# Altium project testSensor.PrjPcb
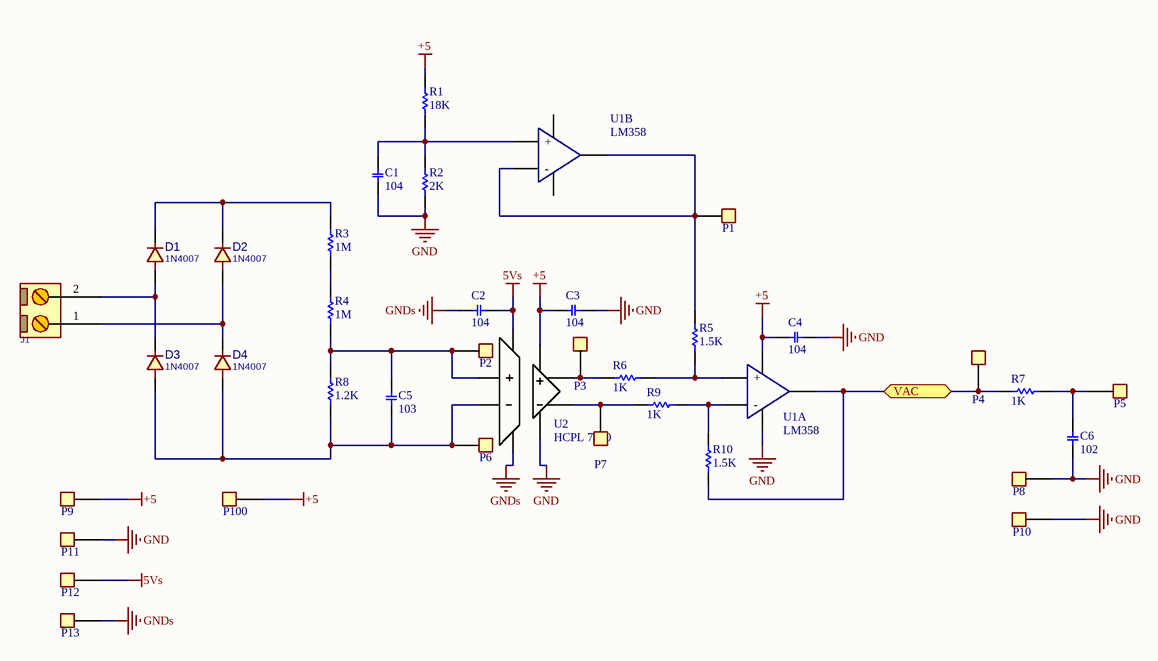
[diagram p0: testSensor.SchDoc]
1 sheet, 37 parts. Net scope: flat (ports and power ports of the same name join across sheets).
Board file: testSensor.PcbDoc

## Sheet testSensor.SchDoc
size A4; SheetNumber: 1; SheetTotal: 1

### Parts
C1  104  [CAP 104]
C2  104  [CAP 104]
C3  104  [CAP 104]
C4  104  [CAP 104]
C5  103  [CAP 104]
C6  102  [CAP 104]
D1  value 1N4007  [1N4007]  (hidden comment: DIODE DIP)
D2  value 1N4007  [1N4007]  (hidden comment: DIODE DIP)
D3  value 1N4007  [1N4007]  (hidden comment: DIODE DIP)
D4  value 1N4007  [1N4007]  (hidden comment: DIODE DIP)
J1  CONN_TB2  [TBG_2]  (value not drawn)
P1  test PCB  [tp_red_1p]  (value not drawn)
P2  test PCB  [tp_red_1p]  (value not drawn)
P3  test PCB  [tp_red_1p]  (value not drawn)
P4  test PCB  [tp_red_1p]  (value not drawn)
P5  test PCB  [tp_red_1p]  (value not drawn)
P6  test PCB  [Tp_black_1p]  (value not drawn)
P7  test PCB  [Tp_black_1p]  (value not drawn)
P8  test PCB  [Tp_black_1p]  (value not drawn)
P9  test PCB  [tp_red_1p]  (value not drawn)
P10  test PCB  [Tp_black_1p]  (value not drawn)
P11  test PCB  [Tp_black_1p]  (value not drawn)
P12  test PCB  [tp_red_1p]  (value not drawn)
P13  test PCB  [Tp_black_1p]  (value not drawn)
P100  test PCB  [tp_red_1p]  (value not drawn)
R1  18K  [R1/4W4]
R2  2K  [R1/4W4]
R3  1M  [R1/4W4]
R4  1M  [R1/4W4]
R5  1.5K  [R1/4W4]
R6  1K  [R1/4W4]
R7  1K  [R1/4W4]
R8  1.2K  [R1/4W4]
R9  1K  [R1/4W4]
R10  1.5K  [R1/4W4]
U1  LM358  [DIP-8_2.54_8_t/h]  (parts A,B of 2)
U2  HCPL 7800  [SOP-8P]

### Ports
VAC (bidir)

### Nets
5Vs: C2.2 P12.1 U2.1(VDD1)
+5: C3.1 C4.1 P9.1 P100.1 R1.2 U1.8(VCC) U2.8(VDD2)
GND: C1.1 C3.2 C4.2 C6.1 P8.1 P10.1 P11.1 R2.1 U1.4(GND) U2.5(GND2)
GNDs: C2.1 P13.1 U2.4(GND1)
NetC1_2: C1.2 R1.1 R2.2 U1.5(+)
NetC5_1: C5.1 D3.1 D4.1 P6.1 R8.1 U2.3(-)
NetC5_2: C5.2 P2.1 R4.1 R8.2 U2.2(+)
NetC6_2: C6.2 P5.1 R7.1
NetD1_1: D1.1 D3.2 J1.2
NetD1_2: D1.2 D2.2 R3.2
NetD2_1: D2.1 D4.2 J1.1
NetP1_1: P1.1 R5.2 U1.6(-) U1.7(OUT2)
NetP3_1: P3.1 R6.2 U2.7(+)
NetP4_1: P4.1 R7.2 R10.1 U1.1(OUT1) ; port VAC
NetP7_1: P7.1 R9.2 U2.6(-)
NetR3_1: R3.1 R4.2
NetR5_1: R5.1 R6.1 U1.3(+)
NetR9_1: R9.1 R10.2 U1.2(-)

### Library data of the parts
C1-C6 = CAP Keo: Value: 0,047uF; Copyright: VanDungEvn
D1-D4 = DIODE DIP: MANF: Kingtronics; DESC: DESCRIPTION; PARAM: 1000V VRRM; PARAM2: 1A; MANF_P#: M7; ASSEMBLY: ASSEMBLY; PRICE: PRICE
J1 = CONN_TB2: CONN, TERMINAL BLOCK, 5.08mm pitch; VALUE: CONN_TB2
P1-P13 P100 = test PCB: testpin
R1-R10 = RES DIP: Value: R1/4W - 1K
U1 = LM358: LM358 Dual Opamp
U2 = HCPL 7800: HCPL 7800 Isolation Amplifer, Opamp